# EAGLE design bmsselect (EAGLE 4.13)
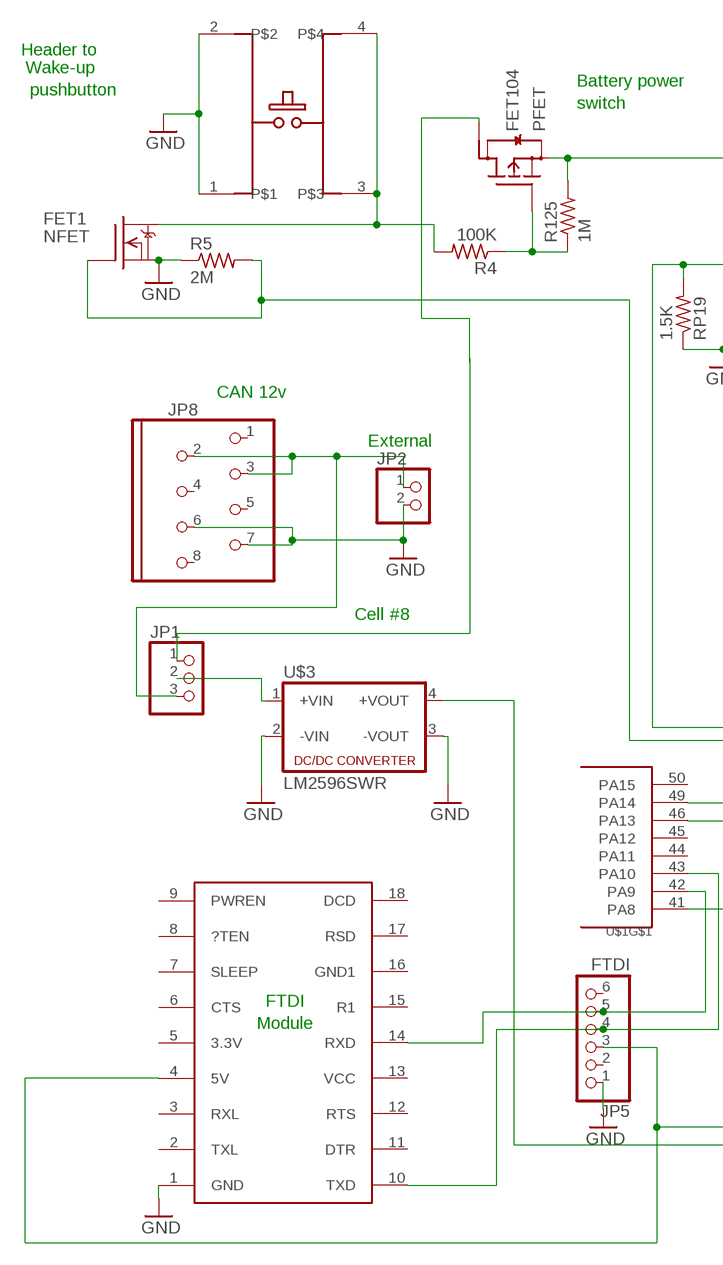
[diagram p0: schematic, sheet 1, part 1 of 2]
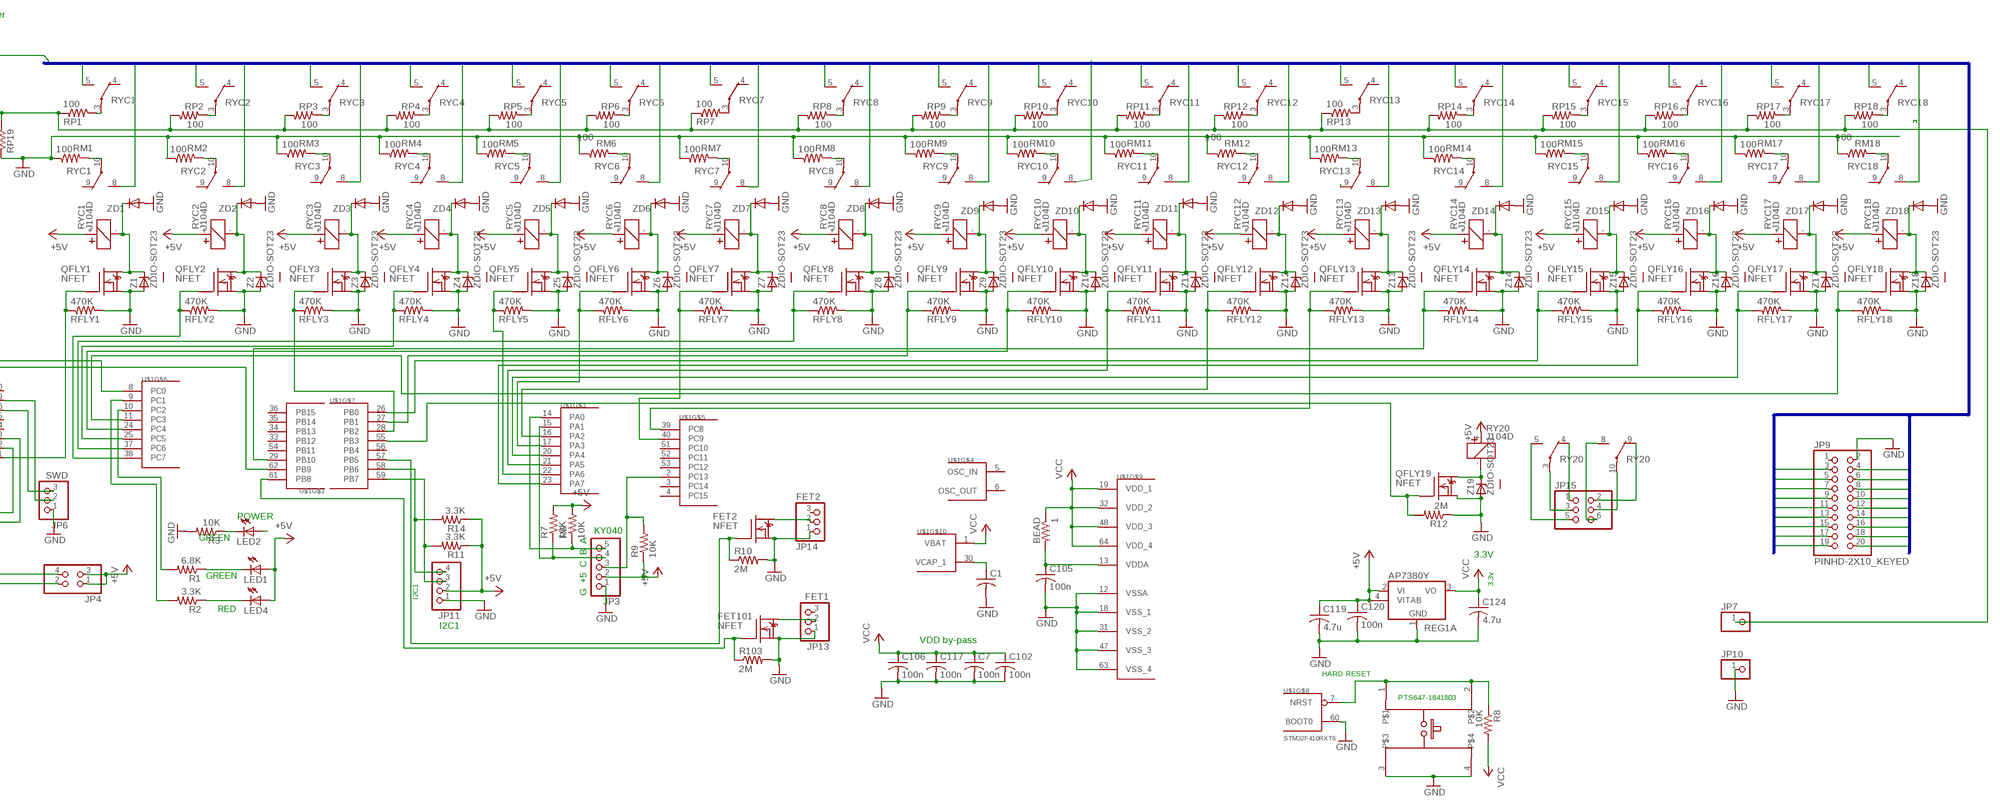
[diagram p1: schematic, sheet 1, part 2 of 2]

## Parts
BEAD  1  R-US_R0603  [R0603]
C1  C-USC0805  [C0805]
C7  100n  C-USC0603  [C0603]
C102  100n  C-USC0603  [C0603]
C105  100n  C-USC0603  [C0603]
C106  100n  C-USC0603  [C0603]
C117  100n  C-USC0603  [C0603]
C119  4.7u  C-USC0805  [C0805]
C120  100n  C-USC0603  [C0603]
C124  4.7u  C-USC0603  [C0603]
FET1  NFET  DMN3404L  [SOT-23]
FET2  NFET  DMN3404L  [SOT-23]
FET101  NFET  DMN3404L  [SOT-23]
FET104  PFET  FET-P-SOT23  [SOT-23]
JP1  PINHD-1X3  [1X03]
JP2  PINHD-1X2  [1X02]
JP3  PINHD-1X5  [1X05]
JP4  PINHD-2X2  [2X02]
JP5  FTDI  PINHD-1X6  [1X06]
JP6  SWD  PINHD-1X3  [1X03]
JP7  PINHD-1X1  [1X01]
JP8  MOD8P8C  [MOD8P8C]
JP9  PINHD-2X10_KEYED  [2X10_KEYED]
JP10  PINHD-1X1  [1X01]
JP11  PINHD-1X4  [1X04]
JP13  FET1  PINHD-1X3  [1X03]
JP14  FET2  PINHD-1X3  [1X03]
JP15  PINHD-2X3  [2X03]
LED1  LEDCHIP-LED0603  [CHIP-LED0603]
LED2  LEDCHIP-LED0603  [CHIP-LED0603]
LED4  LEDCHIP-LED0603  [CHIP-LED0603]
QFLY1  NFET  DMN3404L  [SOT-23]
QFLY2  NFET  DMN3404L  [SOT-23]
QFLY3  NFET  DMN3404L  [SOT-23]
QFLY4  NFET  DMN3404L  [SOT-23]
QFLY5  NFET  DMN3404L  [SOT-23]
QFLY6  NFET  DMN3404L  [SOT-23]
QFLY7  NFET  DMN3404L  [SOT-23]
QFLY8  NFET  DMN3404L  [SOT-23]
QFLY9  NFET  DMN3404L  [SOT-23]
QFLY10  NFET  DMN3404L  [SOT-23]
QFLY11  NFET  DMN3404L  [SOT-23]
QFLY12  NFET  DMN3404L  [SOT-23]
QFLY13  NFET  DMN3404L  [SOT-23]
QFLY14  NFET  DMN3404L  [SOT-23]
QFLY15  NFET  DMN3404L  [SOT-23]
QFLY16  NFET  DMN3404L  [SOT-23]
QFLY17  NFET  DMN3404L  [SOT-23]
QFLY18  NFET  DMN3404L  [SOT-23]
QFLY19  NFET  DMN3404L  [SOT-23]
R1  6.8K  R-US_R0603  [R0603]
R2  3.3K  R-US_R0603  [R0603]
R3  10K  R-US_R0603  [R0603]
R4  100K  R-US_R0603  [R0603]
R5  2M  R-US_R0603  [R0603]
R6  10K  R-US_R0603  [R0603]
R7  10K  R-US_R0603  [R0603]
R8  10K  R-US_R0603  [R0603]
R9  10K  R-US_R0603  [R0603]
R10  2M  R-US_R0603  [R0603]
R11  3.3K  R-US_R0603  [R0603]
R12  2M  R-US_R0603  [R0603]
R14  3.3K  R-US_R0603  [R0603]
R103  2M  R-US_R0603  [R0603]
R125  1M  R-US_R0603  [R0603]
REG1A  AP7380Y  [SOT89]
RESET  E-SWITCH2  [E-SWITCH2]
RESET1  E-SWITCH2  [E-SWITCH2]
RFLY1  470K  R-US_R0603  [R0603]
RFLY2  470K  R-US_R0603  [R0603]
RFLY3  470K  R-US_R0603  [R0603]
RFLY4  470K  R-US_R0603  [R0603]
RFLY5  470K  R-US_R0603  [R0603]
RFLY6  470K  R-US_R0603  [R0603]
RFLY7  470K  R-US_R0603  [R0603]
RFLY8  470K  R-US_R0603  [R0603]
RFLY9  470K  R-US_R0603  [R0603]
RFLY10  470K  R-US_R0603  [R0603]
RFLY11  470K  R-US_R0603  [R0603]
RFLY12  470K  R-US_R0603  [R0603]
RFLY13  470K  R-US_R0603  [R0603]
RFLY14  470K  R-US_R0603  [R0603]
RFLY15  470K  R-US_R0603  [R0603]
RFLY16  470K  R-US_R0603  [R0603]
RFLY17  470K  R-US_R0603  [R0603]
RFLY18  470K  R-US_R0603  [R0603]
RM1  100  R-US_R0603  [R0603]
RM2  100  R-US_R0603  [R0603]
RM3  100  R-US_R0603  [R0603]
RM4  100  R-US_R0603  [R0603]
RM5  100  R-US_R0603  [R0603]
RM6  100  R-US_R0603  [R0603]
RM7  100  R-US_R0603  [R0603]
RM8  100  R-US_R0603  [R0603]
RM9  100  R-US_R0603  [R0603]
RM10  100  R-US_R0603  [R0603]
RM11  100  R-US_R0603  [R0603]
RM12  100  R-US_R0603  [R0603]
RM13  100  R-US_R0603  [R0603]
RM14  100  R-US_R0603  [R0603]
RM15  100  R-US_R0603  [R0603]
RM16  100  R-US_R0603  [R0603]
RM17  100  R-US_R0603  [R0603]
RM18  100  R-US_R0603  [R0603]
RP1  100  R-US_R0603  [R0603]
RP2  100  R-US_R0603  [R0603]
RP3  100  R-US_R0603  [R0603]
RP4  100  R-US_R0603  [R0603]
RP5  100  R-US_R0603  [R0603]
RP6  100  R-US_R0603  [R0603]
RP7  100  R-US_R0603  [R0603]
RP8  100  R-US_R0603  [R0603]
RP9  100  R-US_R0603  [R0603]
RP10  100  R-US_R0603  [R0603]
RP11  100  R-US_R0603  [R0603]
RP12  100  R-US_R0603  [R0603]
RP13  100  R-US_R0603  [R0603]
RP14  100  R-US_R0603  [R0603]
RP15  100  R-US_R0603  [R0603]
RP16  100  R-US_R0603  [R0603]
RP17  100  R-US_R0603  [R0603]
RP18  100  R-US_R0603  [R0603]
RP19  1.5K  R-US_R0603  [R0603]
RY20  J104D  [J104D]
RYC1  J104D  [J104D]
RYC2  J104D  [J104D]
RYC3  J104D  [J104D]
RYC4  J104D  [J104D]
RYC5  J104D  [J104D]
RYC6  J104D  [J104D]
RYC7  J104D  [J104D]
RYC8  J104D  [J104D]
RYC9  J104D  [J104D]
RYC10  J104D  [J104D]
RYC11  J104D  [J104D]
RYC12  J104D  [J104D]
RYC13  J104D  [J104D]
RYC14  J104D  [J104D]
RYC15  J104D  [J104D]
RYC16  J104D  [J104D]
RYC17  J104D  [J104D]
RYC18  J104D  [J104D]
U$1  STM32F410RXT6  [TQFP64]
U$3  LM2596SWR  [LM2596SW]
USB-SERIAL  USB-UART  [USB-UART]
Z1  ZDIO-SOT23  [SOT-23]
Z2  ZDIO-SOT23  [SOT-23]
Z3  ZDIO-SOT23  [SOT-23]
Z4  ZDIO-SOT23  [SOT-23]
Z5  ZDIO-SOT23  [SOT-23]
Z6  ZDIO-SOT23  [SOT-23]
Z7  ZDIO-SOT23  [SOT-23]
Z8  ZDIO-SOT23  [SOT-23]
Z9  ZDIO-SOT23  [SOT-23]
Z10  ZDIO-SOT23  [SOT-23]
Z11  ZDIO-SOT23  [SOT-23]
Z12  ZDIO-SOT23  [SOT-23]
Z13  ZDIO-SOT23  [SOT-23]
Z14  ZDIO-SOT23  [SOT-23]
Z15  ZDIO-SOT23  [SOT-23]
Z16  ZDIO-SOT23  [SOT-23]
Z17  ZDIO-SOT23  [SOT-23]
Z18  ZDIO-SOT23  [SOT-23]
Z19  ZDIO-SOT23  [SOT-23]
ZD1  DIODE-SOD80C  [SOD80C]
ZD2  DIODE-SOD80C  [SOD80C]
ZD3  DIODE-SOD80C  [SOD80C]
ZD4  DIODE-SOD80C  [SOD80C]
ZD5  DIODE-SOD80C  [SOD80C]
ZD6  DIODE-SOD80C  [SOD80C]
ZD7  DIODE-SOD80C  [SOD80C]
ZD8  DIODE-SOD80C  [SOD80C]
ZD9  DIODE-SOD80C  [SOD80C]
ZD10  DIODE-SOD80C  [SOD80C]
ZD11  DIODE-SOD80C  [SOD80C]
ZD12  DIODE-SOD80C  [SOD80C]
ZD13  DIODE-SOD80C  [SOD80C]
ZD14  DIODE-SOD80C  [SOD80C]
ZD15  DIODE-SOD80C  [SOD80C]
ZD16  DIODE-SOD80C  [SOD80C]
ZD17  DIODE-SOD80C  [SOD80C]
ZD18  DIODE-SOD80C  [SOD80C]

## Nets
1-KY040-BN$21: JP3.4 R7.1 U$1.15(PA1)
5VDC-DC: JP4.2 U$3.4(+VOUT)
+5V: C119.1 C120.1 JP3.2 JP4.1 JP4.3 JP11.2 LED1.A LED2.A LED4.A R6.2 R7.2 R9.1 R11.1 R14.1 REG1A.2(VI) REG1A.4(VITAB) RY20.+ RYC1.+ RYC2.+ RYC3.+ RYC4.+ RYC5.+ RYC6.+ RYC7.+ RYC8.+ RYC9.+ RYC10.+ RYC11.+ RYC12.+ RYC13.+ RYC14.+ RYC15.+ RYC16.+ RYC17.+ RYC18.+
BATSW-NDRAIN: FET1.3(D) R4.2 RESET1.3 RESET1.4
BATSW-PGATE: FET104.1(G) R4.1 R125.1
C0: RYC1.8(S)
C1: JP9.12 RYC1.5(S) RYC2.8(S)
C2: JP9.3 RYC2.5(S) RYC3.8(S)
C3: JP9.13 RYC3.5(S) RYC4.8(S)
C4: JP9.4 RYC4.5(S) RYC5.8(S)
C5: JP9.14 RYC5.5(S) RYC6.8(S)
C6: JP9.5 RYC6.5(S) RYC7.8(S)
C7: JP9.15 RYC7.5(S) RYC8.8(S)
C8: FET104.2(S) JP9.6 R125.2 RYC8.5(S) RYC9.8(S)
C9: JP9.16 RYC9.5(S) RYC10.8(S)
C10: JP9.7 RYC10.5(S) RYC11.8(S)
C11: JP9.17 RYC11.5(S) RYC12.8(S)
C12: JP9.8 RYC12.5(S) RYC13.8(S)
C13: JP9.18 RYC13.5(S) RYC14.8(S)
C14: JP9.9 RYC14.5(S) RYC15.8(S)
C15: JP9.19 RYC15.5(S) RYC16.8(S)
C16: JP9.10 RYC16.5(S) RYC17.8(S)
C17: JP9.20 RYC17.5(S) RYC18.8(S)
C18: JP9.11 RYC18.5(S)
C20: RYC13.9(O)
CELL8-PFET-DRAIN: FET104.3(D) JP1.1
EXTERNAL_7-35V: JP1.3 JP2.1 JP8.2 JP8.3
FET1-DRAIN: FET101.3(D) JP13.2
FET2-DRAIN: FET2.3(D) JP14.2
GND: C1.2 C7.2 C102.2 C105.2 C106.2 C117.2 C119.2 C120.2 C124.2 FET1.2(S) FET2.2(S) FET101.2(S) JP2.2 JP3.1 JP5.1 JP6.1 JP8.6 JP8.7 JP9.2 JP10.1 JP11.1 JP13.1 JP14.1 QFLY1.2(S) QFLY2.2(S) QFLY3.2(S) QFLY4.2(S) QFLY5.2(S) QFLY6.2(S) QFLY7.2(S) QFLY8.2(S) QFLY9.2(S) QFLY10.2(S) QFLY11.2(S) QFLY12.2(S) QFLY13.2(S) QFLY14.2(S) QFLY15.2(S) QFLY16.2(S) QFLY17.2(S) QFLY18.2(S) QFLY19.2(S) R3.2 R5.1 R10.2 R12.1 R103.2 REG1A.1(GND) RESET1.1 RESET1.2 RESET.3 RESET.4 RFLY1.2 RFLY2.2 RFLY3.2 RFLY4.2 RFLY5.2 RFLY6.2 RFLY7.2 RFLY8.2 RFLY9.2 RFLY10.2 RFLY11.2 RFLY12.2 RFLY13.2 RFLY14.2 RFLY15.2 RFLY16.2 RFLY17.2 RFLY18.2 RM1.1 RM2.1 RM3.1 RM4.1 RM5.1 RM6.1 RM7.1 RM8.1 RM9.1 RM10.1 RM11.1 RM12.1 RM13.1 RM14.1 RM15.1 RM16.1 RM17.1 RM18.1 RP19.1 U$1.12(VSSA) U$1.18(VSS_1) U$1.31(VSS_2) U$1.47(VSS_3) U$1.60(BOOT0) U$1.63(VSS_4) U$3.2(-VIN) U$3.3(-VOUT) USB-SERIAL.1(GND) Z1.1(A) Z2.1(A) Z3.1(A) Z4.1(A) Z5.1(A) Z6.1(A) Z7.1(A) Z8.1(A) Z9.1(A) Z10.1(A) Z11.1(A) Z12.1(A) Z13.1(A) Z14.1(A) Z15.1(A) Z16.1(A) Z17.1(A) Z18.1(A) Z19.1(A) ZD1.A ZD2.A ZD3.A ZD4.A ZD5.A ZD6.A ZD7.A ZD8.A ZD9.A ZD10.A ZD11.A ZD12.A ZD13.A ZD14.A ZD15.A ZD16.A ZD17.A ZD18.A
LED-EXT-GRN-CATHODE1: LED1.C R1.1
LED-EXT-GRN-CATHODE2: LED2.C R3.1
LED-EXT-RED-CATHODE1: LED4.C R2.1
N$2: RM1.2 RYC1.10(P)
N$3: RP2.1 RYC2.3(P)
N$4: RM4.2 RYC4.10(P)
N$5: RM3.2 RYC3.10(P)
N$6: RM2.2 RYC2.10(P)
N$7: RM5.2 RYC5.10(P)
N$8: RM6.2 RYC6.10(P)
N$9: JP1.2 U$3.1(+VIN)
N$12: RP10.1 RYC10.3(P)
N$13: JP15.1 RY20.4(O)
N$14: RP11.1 RYC11.3(P)
N$16: RP12.1 RYC12.3(P)
N$17: RP7.2 RYC7.3(P)
N$18: RP8.1 RYC8.3(P)
N$19: RP9.1 RYC9.3(P)
N$20: JP3.3 R9.2 U$1.2(PC13)
N$21: JP15.2 RY20.9(O)
N$22: JP15.4 RY20.10(P)
N$23: JP15.3 RY20.3(P)
N$25: JP15.6 RY20.8(S)
N$26: JP15.5 RY20.5(S)
N$29: RP3.1 RYC3.3(P)
N$31: RP1.2 RYC1.3(P)
N$34: RM7.2 RYC7.10(P)
N$35: RM10.2 RYC10.10(P)
N$36: RM9.2 RYC9.10(P)
N$37: RM8.2 RYC8.10(P)
N$38: RM11.2 RYC11.10(P)
N$39: RM12.2 RYC12.10(P)
N$43: RP16.1 RYC16.3(P)
N$44: RP17.1 RYC17.3(P)
N$45: RP18.1 RYC18.3(P)
N$46: RP13.2 RYC13.3(P)
N$47: RP14.1 RYC14.3(P)
N$48: RP15.1 RYC15.3(P)
N$49: RP4.1 RYC4.3(P)
N$50: RP5.1 RYC5.3(P)
N$51: RP6.1 RYC6.3(P)
N$58: RM13.2 RYC13.10(P)
N$59: RM16.2 RYC16.10(P)
N$60: RM15.2 RYC15.10(P)
N$61: RM14.2 RYC14.10(P)
N$62: RM17.2 RYC17.10(P)
N$63: RM18.2 RYC18.10(P)
NRST: R8.1 RESET.1 RESET.2 U$1.7(NRST)
PA0-KY040-A: JP3.5 R6.1 U$1.14(PA0)
PA2-QFLY12: QFLY12.1(G) RFLY12.1 U$1.16(PA2)
PA3-QFLY6: QFLY6.1(G) RFLY6.1 U$1.17(PA3)
PA4-QFLY17: QFLY17.1(G) RFLY17.1 U$1.20(PA4)
PA5-QFLY11: QFLY11.1(G) RFLY11.1 U$1.21(PA5)
PA6-QFLY5: QFLY5.1(G) RFLY5.1 U$1.22(PA6)
PA7-QFLY16: QFLY16.1(G) RFLY16.1 U$1.23(PA7)
PA8-QFLY1: QFLY1.1(G) RFLY1.1 U$1.41(PA8)
PA9-USART1-TX: JP5.5 U$1.42(PA9) USB-SERIAL.14(RXD)
PA10-USART1-RX: JP5.4 U$1.43(PA10) USB-SERIAL.10(TXD)
PA13-SWDIO: JP6.3 U$1.46(PA13)
PA14-SWCLK: JP6.2 U$1.49(PA14)
PB0-QFLY15: QFLY15.1(G) RFLY15.1 U$1.26(PB0)
PB1-QFLY9: QFLY9.1(G) RFLY9.1 U$1.27(PB1)
PB2-QFLY3: QFLY3.1(G) RFLY3.1 U$1.28(PB2)
PB3-RY19-FET-GATE: QFLY19.1(G) R12.2 U$1.55(PB3)
PB5-FET2-GATE: FET2.1(G) R10.1 U$1.57(PB5)
PB6-I2C1-SCL: JP11.4 R14.2 U$1.58(PB6)
PB7-I2C2-SDA: JP11.3 R11.2 U$1.59(PB7)
PB8-FET1-GATE: FET101.1(G) R103.1 U$1.61(PB8)
PB9-CELL8-NFET: FET1.1(G) R5.2 U$1.62(PB9)
PB10-QFLY14: QFLY14.1(G) RFLY14.1 U$1.29(PB10)
PC0-IN10: JP7.1 RP1.1 RP2.2 RP3.2 RP4.2 RP5.2 RP6.2 RP7.1 RP8.2 RP9.2 RP10.2 RP11.2 RP12.2 RP13.1 RP14.2 RP15.2 RP16.2 RP17.2 RP18.2 RP19.2 U$1.8(PC0)
PC1-LED-RED: R2.2 U$1.9(PC1)
PC2-LED-GRN: R1.2 U$1.10(PC2)
PC3-QFLY18: QFLY18.1(G) RFLY18.1 U$1.11(PC3)
PC4-QFLY10: QFLY10.1(G) RFLY10.1 U$1.24(PC4)
PC5-QFLY4: QFLY4.1(G) RFLY4.1 U$1.25(PC5)
PC6-QFLY8: QFLY8.1(G) RFLY8.1 U$1.37(PC6)
PC7-QFLY2: QFLY2.1(G) RFLY2.1 U$1.38(PC7)
PC8-QFLY13: QFLY13.1(G) RFLY13.1 U$1.39(PC8)
PC9-QFLY7: QFLY7.1(G) RFLY7.1 U$1.40(PC9)
QDFLY1: QFLY1.3(D) RYC1.- Z1.3(C) ZD1.C
QDFLY2: QFLY2.3(D) RYC2.- Z2.3(C) ZD2.C
QDFLY3: QFLY3.3(D) RYC3.- Z3.3(C) ZD3.C
QDFLY4: QFLY4.3(D) RYC4.- Z4.3(C) ZD4.C
QDFLY5: QFLY5.3(D) RYC5.- Z5.3(C) ZD5.C
QDFLY6: QFLY6.3(D) RYC6.- Z6.3(C) ZD6.C
QDFLY7: QFLY7.3(D) RYC7.- Z7.3(C) ZD7.C
QDFLY8: QFLY8.3(D) RYC8.- Z8.3(C) ZD8.C
QDFLY9: QFLY9.3(D) RYC9.- Z9.3(C) ZD9.C
QDFLY10: QFLY10.3(D) RYC10.- Z10.3(C) ZD10.C
QDFLY11: QFLY11.3(D) RYC11.- Z11.3(C) ZD11.C
QDFLY12: QFLY12.3(D) RYC12.- Z12.3(C) ZD12.C
QDFLY13: QFLY13.3(D) RYC13.- Z13.3(C) ZD13.C
QDFLY14: QFLY14.3(D) RYC14.- Z14.3(C) ZD14.C
QDFLY15: QFLY15.3(D) RYC15.- Z15.3(C) ZD15.C
QDFLY16: QFLY16.3(D) RYC16.- Z16.3(C) ZD16.C
QDFLY17: QFLY17.3(D) RYC17.- Z17.3(C) ZD17.C
QDFLY18: QFLY18.3(D) RYC18.- Z18.3(C) ZD18.C
QFLY19-DRAIN: QFLY19.3(D) RY20.- Z19.3(C)
USB-SERIAL-5V: JP4.4 JP5.3 USB-SERIAL.4(5V)
VCAP_1: C1.1 U$1.30(VCAP_1)
VCC: BEAD.1 C7.1 C102.1 C106.1 C117.1 C124.1 R8.2 REG1A.3(VO) U$1.1(VBAT) U$1.19(VDD_1) U$1.32(VDD_2) U$1.48(VDD_3) U$1.64(VDD_4)
VDDA: BEAD.2 C105.1 U$1.13(VDDA)
Unconnected: JP5.2 JP5.6 JP8.1 JP8.4 JP8.5 JP8.8 JP9.1 JP13.3 JP14.3 RYC1.4(O) RYC1.9(O) RYC2.4(O) RYC2.9(O) RYC3.4(O) RYC3.9(O) RYC4.4(O) RYC4.9(O) RYC5.4(O) RYC5.9(O) RYC6.4(O) RYC6.9(O) RYC7.4(O) RYC7.9(O) RYC8.4(O) RYC8.9(O) RYC9.4(O) RYC9.9(O) RYC10.4(O) RYC10.9(O) RYC11.4(O) RYC11.9(O) RYC12.4(O) RYC12.9(O) RYC13.4(O) RYC14.4(O) RYC14.9(O) RYC15.4(O) RYC15.9(O) RYC16.4(O) RYC16.9(O) RYC17.4(O) RYC17.9(O) RYC18.4(O) RYC18.9(O) U$1.3(PC14) U$1.4(PC15) U$1.5(OSC_IN) U$1.6(OSC_OUT) U$1.33(PB12) U$1.34(PB13) U$1.35(PB14) U$1.36(PB15) U$1.44(PA11) U$1.45(PA12) U$1.50(PA15) U$1.51(PC10) U$1.52(PC11) U$1.53(PC12) U$1.54(PB11) U$1.56(PB4) USB-SERIAL.2(TXL) USB-SERIAL.3(RXL) USB-SERIAL.5(3.3V) USB-SERIAL.6(CTS) USB-SERIAL.7(SLEEP) USB-SERIAL.8(?TEN) USB-SERIAL.9(PWREN) USB-SERIAL.11(DTR) USB-SERIAL.12(RTS) USB-SERIAL.13(VCC) USB-SERIAL.15(R1) USB-SERIAL.16(GND1) USB-SERIAL.17(RSD) USB-SERIAL.18(DCD) Z1.2(NC) Z2.2(NC) Z3.2(NC) Z4.2(NC) Z5.2(NC) Z6.2(NC) Z7.2(NC) Z8.2(NC) Z9.2(NC) Z10.2(NC) Z11.2(NC) Z12.2(NC) Z13.2(NC) Z14.2(NC) Z15.2(NC) Z16.2(NC) Z17.2(NC) Z18.2(NC) Z19.2(NC)

## Buses
C$1:C[0..18]

## Notes on the sheet
- Header to
- Wake-up
- Battery power
- pushbutton
- switch
- CAN 12v
- External
- Cell #8
- FTDI
- Module | POWER
- KY040
- GREEN
- 3.3V
- 3.3v
- GREEN
- I2C1
- G  +5  C  B  A
- RED
- I2C1
- VDD by-pass
- HARD | RESET
- PTS647-1841803

## Library data of the parts
BEAD R1-R12 R14 R103 R125 RFLY1-RFLY18 RM1-RM18 RP1-RP19 = rcl:R-US_: RESISTOR, American symbol
C1 C7 C102 C105 C106 C117 C119 C120 C124 = rcl:C-US: CAPACITOR, American symbol
FET1 FET2 FET101 QFLY1-QFLY19 = transistor-fet:DMN3404L
FET104 = transistor-fet:FET-P-SOT23
JP1 JP6 JP13 JP14 = pinhead:PINHD-1X3: PIN HEADER
JP2 = pinhead:PINHD-1X2: PIN HEADER
JP3 = pinhead:PINHD-1X5: PIN HEADER
JP4 = pinhead:PINHD-2X2: PIN HEADER
JP5 = pinhead:PINHD-1X6: PIN HEADER
JP7 JP10 = pinhead:PINHD-1X1: PIN HEADER
JP8 = DEH:MOD8P8C
JP9 = pinhead:PINHD-2X10_KEYED
JP11 = pinhead:PINHD-1X4: PIN HEADER
JP15 = pinhead:PINHD-2X3: PIN HEADER
LED1 LED2 LED4 = led:LED: LED OSRAM: - CHIPLED LG R971, LG N971, LY N971, LG Q971, LY Q971, LO R971, LY R971 LH N974, LH R974 LS Q976, LO Q976, LY Q976 LO Q996 - Hyper CHIPLED LW Q18S LB Q993, LB Q99A, LB R99A - SideLED LS A670, LO A670, LY A670, LG A670, LP A670 LB A673, LV A673, LT A673, LW A673 LH A674 LY A675 LS A676, LA A676, LO A676, LY A676, LW A676 LS A679, LY A679, LG A679 - Hyper Micro SIDELED® LS Y876, LA Y876, LO Y876, LY Y876 LT Y87S - SmartLED LW L88C, LW L88S LB L89C, LB L89S, LG L890 LS L89K, LO L89K, LY L89K LS L896, LA L896, LO L896, LY L896 - TOPLED LS T670, LO T670, LY T670, LG T670, LP T670 LSG T670, LSP T670, LSY T670, LOP T670, LYG T670 LG T671, LOG T671, LSG T671 LB T673, LV T673, LT T673, LW T673 LH T674 LS T676, LA T676, LO T676, LY T676, LB T676, LH T676, LSB T676, LW T676 LB T67C, LV T67C, LT T67C, LS T67K, LO T67K, LY T67K, LW E67C LS E67B, LA E67B, LO E67B, LY E67B, LB E67C, LV E67C, LT E67C LW T67C LS T679, LY T679, LG T679 LS T770, LO T770, LY T770, LG T770, LP T770 LB T773, LV T773, LT T773, LW T773 LH T774 LS E675, LA E675, LY E675, LS T675 LS T776, LA T776, LO T776, LY T776, LB T776 LHGB T686 LT T68C, LB T68C - Hyper Mini TOPLED® LB M676 - Mini TOPLED Santana® LG M470 LS M47K, LO M47K, LY M47K Source: http://www.osram.convergy.de/
REG1A = linear:AP7380Y
RESET RESET1 = switch-misc:E-SWITCH2
RY20 RYC1-RYC18 = relay:J104D
U$1 = stm32:STM32F410RXT6
U$3 = dc-dc-converter:LM2596SWR
USB-SERIAL = pinhead:USB-UART
Z1-Z19 = DEH:ZDIO-SOT23
ZD1-ZD18 = diode-1:DIODE-: DIODE

## Board
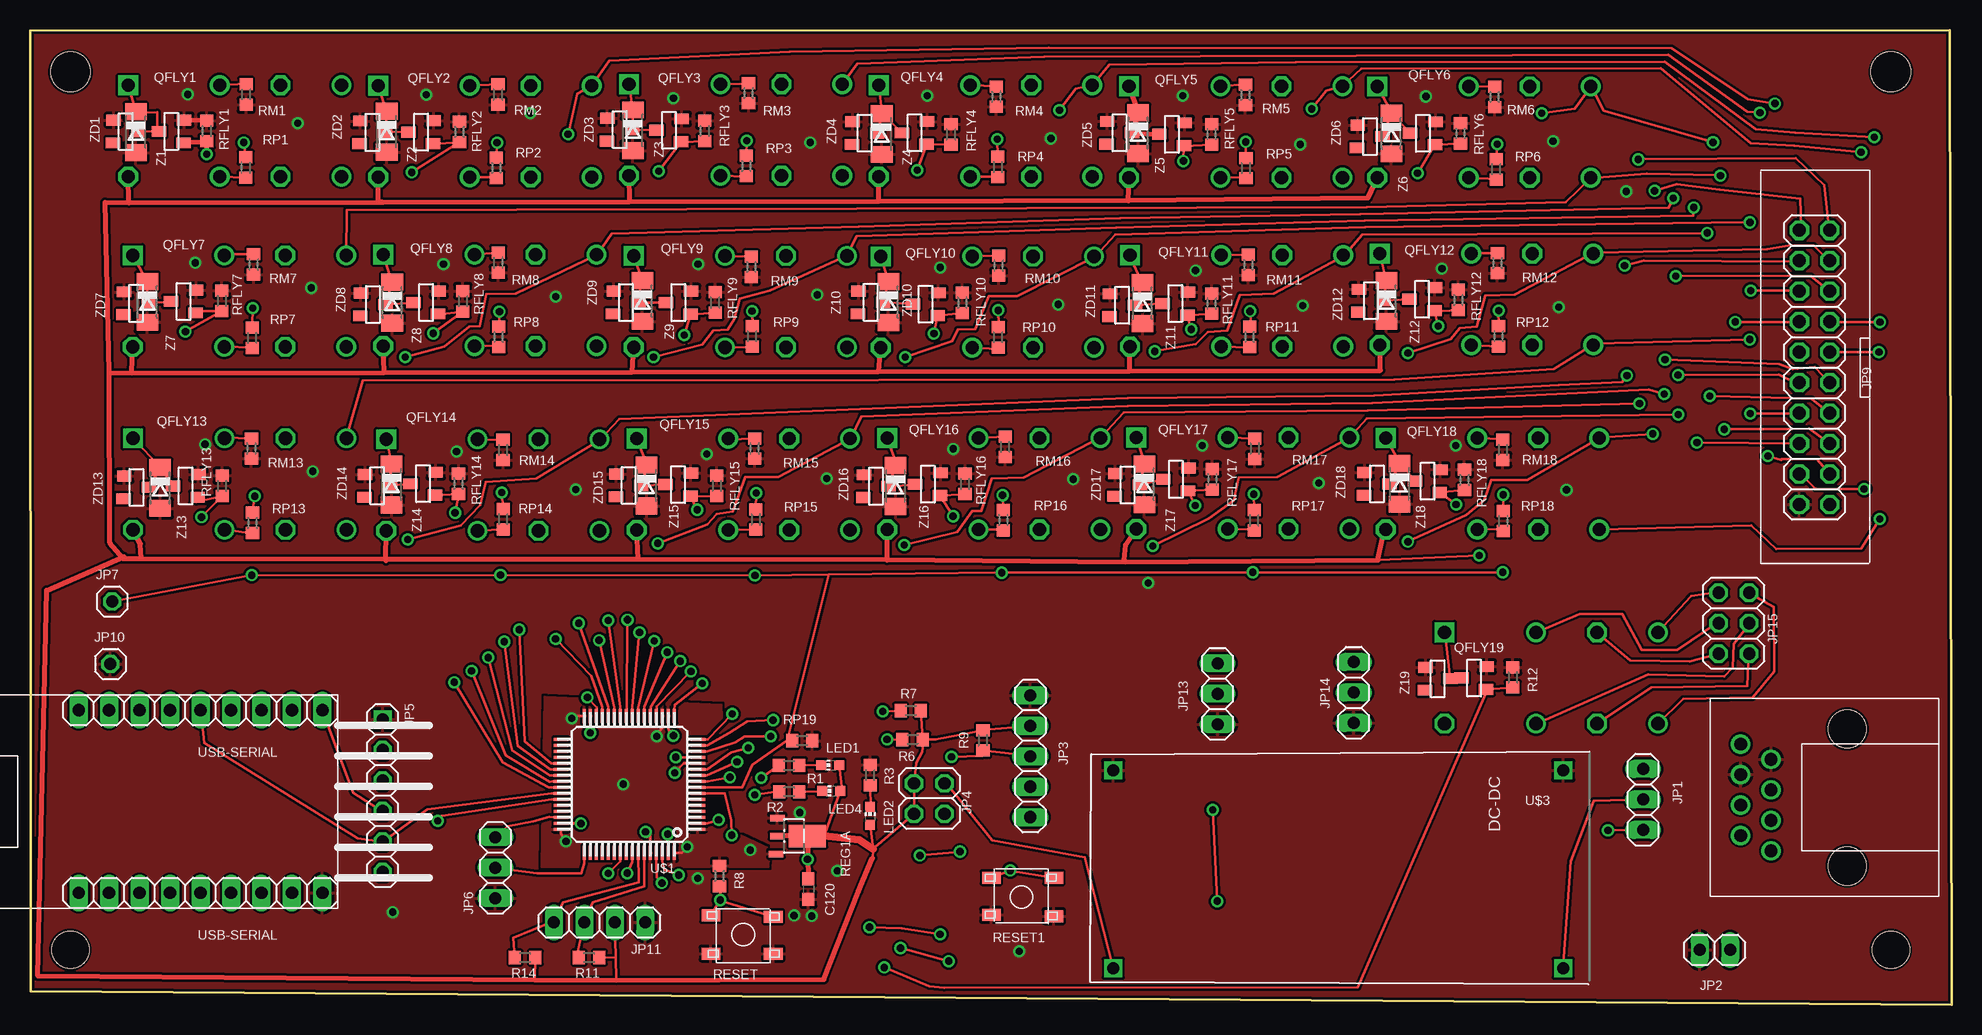
[diagram p2: board, top side]
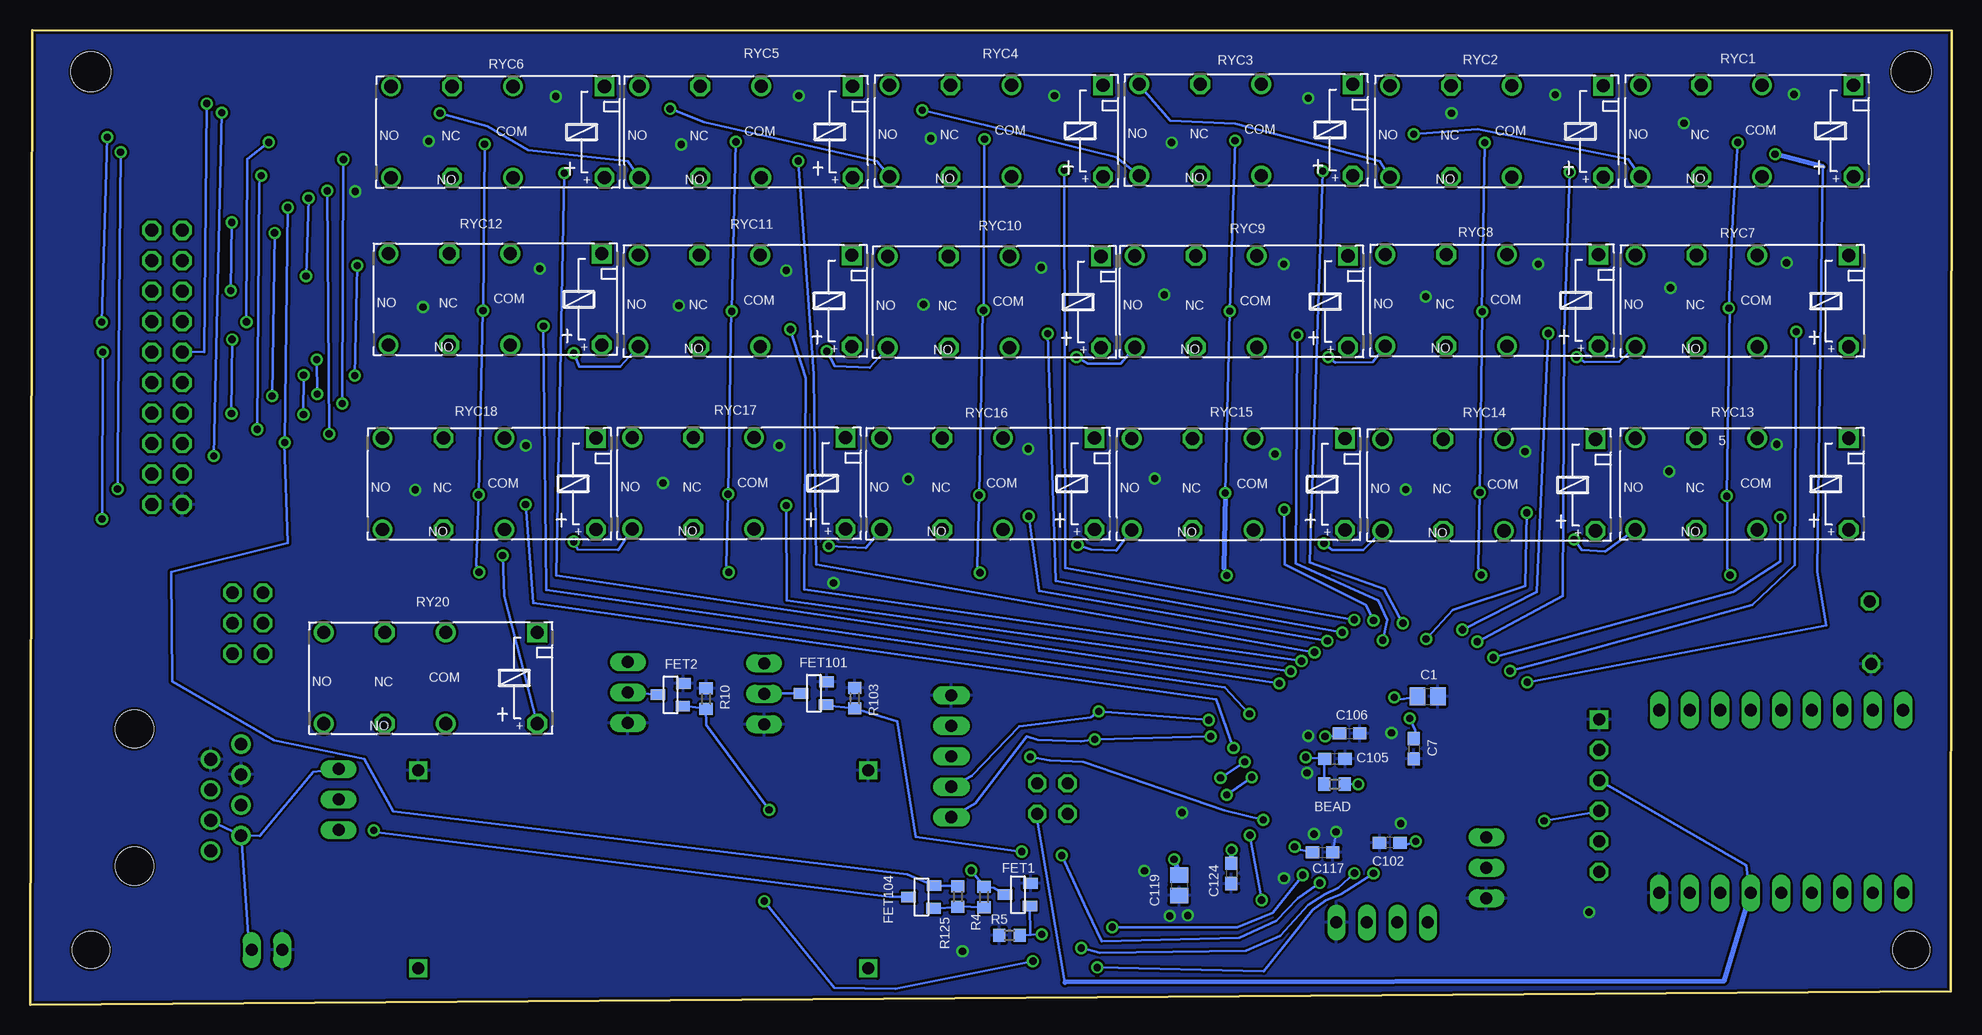
[diagram p3: board, bottom side, seen from below]

Size 160.14 x 81.29 mm. Coordinates in mm from the lower left corner, seen from the top.
Outline: 0.07,1.16 0,81.24 159.97,81.29 160.14,0 0.07,1.16
Copper layers (1*16): Top 0.035mm / dielectric 1.5mm / Bottom 0.035mm
Design rules "default": minimum track width 8mil, minimum drill 0.6mm, track to track 8mil, track to pad 8mil, pad to pad 8mil, via to via 8mil, smd to smd 0mil, copper to edge 8mil, drill to drill 8mil, minimum pad ring 10mil, minimum via ring 8mil, stop-mask expansion 4mil, vias tented up to drill 0mil, thermal gap 10mil
Holes 3.1 mm at 3.37,4.6 155.07,4.6
Holes 3.3 mm at 3.37,77.8 155.07,77.8

### Footprints (pad centres in the part's own frame; a part is rotated, then mirrored left to right if it is on the bottom)
R0603 = smd 1 x 1.1: 1 -0.85,0; 2 0.85,0
C0805 = smd 1.3 x 1.5: 1 -0.85,0; 2 0.85,0
C0603 = smd 1.1 x 1: 1 -0.85,0; 2 0.85,0
SOT-23 = smd 0.9 x 1.2: 1 -1,-1.006; 2 0.9,-1.056; 3 -0.05,1.056
1X03 = drill 1 long: 1 -2.54,0; 2 0,0; 3 2.54,0
1X02 = drill 1 long: 1 -1.27,0; 2 1.27,0
1X05 = drill 1.016 long: 1 -5.08,0; 2 -2.54,0; 3 0,0; 4 2.54,0; 5 5.08,0
2X02 = drill 1.016 octagon: 1 -1.27,-1.27; 2 -1.27,1.27; 3 1.27,-1.27; 4 1.27,1.27
1X06 = drill 1 square: 1 -6.35,0 | drill 1 octagon: 2 -3.81,0; 3 -1.27,0; 4 1.27,0; 5 3.81,0; 6 6.35,0
1X01 = drill 1 octagon: 1 0,0
MOD8P8C = drill 1.067 pad 1.397 round: 1 -3.81,-2.54; 2 -2.54,0; 3 -1.27,-2.54; 4 0,0; 5 1.27,-2.54; 6 2.54,0; 7 3.81,-2.54; 8 5.08,0 | hole 3.175: -5.08,-8.89; 6.35,-8.89
2X10_KEYED = drill 1.067 octagon: 1 -11.46,-1.27; 2 -11.46,1.27; 3 -8.92,-1.27; 4 -8.92,1.27; 5 -6.38,-1.27; 6 -6.38,1.27; 7 -3.84,-1.27; 8 -3.84,1.27; 9 -1.3,-1.27; 10 -1.3,1.27; 11 1.24,-1.27; 12 1.24,1.27; 13 3.78,-1.27; 14 3.78,1.27; 15 6.32,-1.27; 16 6.32,1.27; 17 8.86,-1.27; 18 8.86,1.27; 19 11.4,-1.27; 20 11.4,1.27
1X04 = drill 1 long: 1 -3.81,0; 2 -1.27,0; 3 1.27,0; 4 3.81,0
2X03 = drill 1.016 octagon: 1 -2.54,-1.27; 2 -2.54,1.27; 3 0,-1.27; 4 0,1.27; 5 2.54,-1.27; 6 2.54,1.27
CHIP-LED0603 = smd 0.8 x 0.8: A 0,-0.75; C 0,0.75
SOT89 = smd 0.55 x 1.2: 1 -1.5,-1.4; 2 0,-1.4; 3 1.5,-1.5 | smd 1.85 x 3.1: 4 0,1.1
E-SWITCH2 = smd 1.55 x 1: 1 -2.7,1.6; 2 2.5,1.5; 3 2.5,-1.6; 4 -2.7,-1.6
J104D = drill 1.1 round: 3 0,6.35; 5 10.16,6.35; 8 10.16,-1.27; 10 0,-1.27 | drill 1.1 octagon: 4 5.08,6.35; 9 5.08,-1.27; + -7.62,6.35 | drill 1.1 square: - -7.62,-1.27
TQFP64 = smd 1.2 x 0.26: 1 -5.7,3.75; 2 -5.7,3.25; 3 -5.7,2.75; 4 -5.7,2.25; 5 -5.7,1.75; 6 -5.7,1.25; 7 -5.7,0.75; 8 -5.7,0.25; 9 -5.7,-0.25; 10 -5.7,-0.75; 11 -5.7,-1.25; 12 -5.7,-1.75; 13 -5.7,-2.25; 14 -5.7,-2.75; 15 -5.7,-3.25; 16 -5.7,-3.75; 33 5.7,-3.75; 34 5.7,-3.25; 35 5.7,-2.75; 36 5.7,-2.25; 37 5.7,-1.75; 38 5.7,-1.25; 39 5.7,-0.75; 40 5.7,-0.25; 41 5.7,0.25; 42 5.7,0.75; 43 5.7,1.25; 44 5.7,1.75; 45 5.7,2.25; 46 5.7,2.75; 47 5.7,3.25; 48 5.7,3.75 | smd 0.26 x 1.2: 17 -3.75,-5.7; 18 -3.25,-5.7; 19 -2.75,-5.7; 20 -2.25,-5.7; 21 -1.75,-5.7; 22 -1.25,-5.7; 23 -0.75,-5.7; 24 -0.25,-5.7; 25 0.25,-5.7; 26 0.75,-5.7; 27 1.25,-5.7; 28 1.75,-5.7; 29 2.25,-5.7; 30 2.75,-5.7; 31 3.25,-5.7; 32 3.75,-5.7; 49 3.75,5.7; 50 3.25,5.7; 51 2.75,5.7; 52 2.25,5.7; 53 1.75,5.7; 54 1.25,5.7; 55 0.75,5.7; 56 0.25,5.7; 57 -0.25,5.7; 58 -0.75,5.7; 59 -1.25,5.7; 60 -1.75,5.7; 61 -2.25,5.7; 62 -2.75,5.7; 63 -3.25,5.7; 64 -3.75,5.7
LM2596SW = drill 1 square: 1 0,16.5; 2 0,0; 3 37.5,0; 4 37.5,16.5
USB-UART = drill 1.016 long: 1 -7.62,-8.89; 2 -7.62,-6.35; 3 -7.62,-3.81; 4 -7.62,-1.27; 5 -7.62,1.27; 6 -7.62,3.81; 7 -7.62,6.35; 8 -7.62,8.89; 9 -7.62,11.43; 10 7.62,-8.89; 11 7.62,-6.35; 12 7.62,-3.81; 13 7.62,-1.27; 14 7.62,1.27; 15 7.62,3.81; 16 7.62,6.35; 17 7.62,8.89; 18 7.62,11.43
SOD80C = smd 1.4 x 1.8: A 1.7,0; C -1.7,0

### Placement (x,y rotation side)
BEAD  51.42,18.42 180 bottom
C1  43.67,25.73 0 bottom
C7  44.82,21.36 270 bottom
C102  46.83,13.54 180 bottom
C105  51.4,20.53 0 bottom
C106  50.17,22.64 0 bottom
C117  52.42,12.72 0 bottom
C119  64.38,9.98 270 bottom
C120  64.87,9.66 270 top
C124  60.03,10.97 270 bottom
FET1  77.82,9.25 90 bottom
FET2  106.75,25.92 90 bottom
FET101  94.82,26.04 90 bottom
FET104  85.86,9.05 90 bottom
JP1  134.42,17.13 90 top
JP2  140.41,4.59 180 top
JP3  83.36,20.74 270 top
JP4  74.94,17.21 270 top
JP5  29.39,17.44 270 top
JP6  38.78,11.44 90 top
JP7  6.84,33.64 0 top
JP8  142.55,16.67 90 top
JP9  148.72,53.19 90 top
JP10  6.7,28.43 0 top
JP11  47.46,6.88 180 top
JP13  98.96,25.94 90 top
JP14  110.31,26.05 90 top
JP15  141.99,31.83 90 top
LED1  66.69,20 90 top
LED2  70.01,15.77 0 top
LED4  66.77,17.85 90 top
QFLY1  11.79,72.88 90 top
QFLY2  32.59,72.82 90 top
QFLY3  53.25,72.98 90 top
QFLY4  73.71,72.76 90 top
QFLY5  95.16,72.64 90 top
QFLY6  116.07,72.73 90 top
QFLY7  12.8,58.71 90 top
QFLY8  33.01,58.62 90 top
QFLY9  54.04,58.61 90 top
QFLY10  74.64,58.48 90 top
QFLY11  95.44,58.53 90 top
QFLY12  116.02,58.9 90 top
QFLY13  12.97,43.33 90 top
QFLY14  32.76,43.51 90 top
QFLY15  54.02,43.44 90 top
QFLY16  74.82,43.47 90 top
QFLY17  95.49,43.88 90 top
QFLY18  116.47,43.73 90 top
QFLY19  120.34,27.31 90 top
R1  63.26,19.97 180 top
R2  63.27,17.78 180 top
R3  70.01,19.17 90 top
R4  80.64,9.01 90 bottom
R5  78.52,5.81 0 bottom
R6  73.55,22.13 0 top
R7  73.4,24.54 0 top
R8  57.46,10.76 90 top
R9  79.41,22.06 270 top
R10  103.8,25.53 90 bottom
R11  46.59,3.95 180 top
R12  123.57,27.31 270 top
R14  41.26,3.95 180 top
R103  91.41,25.57 90 bottom
R125  82.82,9.04 90 bottom
REG1A  63.68,14.09 270 top
RESET  59.44,5.87 0 top
RESET1  82.62,9.01 180 top
RFLY1  14.73,72.86 90 top
RFLY2  35.79,72.8 90 top
RFLY3  56.23,72.87 90 top
RFLY4  76.75,72.57 90 top
RFLY5  98.47,72.59 90 top
RFLY6  119.21,72.66 90 top
RFLY7  15.99,58.71 90 top
RFLY8  36.07,58.67 90 top
RFLY9  57.1,58.57 90 top
RFLY10  77.7,58.55 90 top
RFLY11  98.47,58.48 90 top
RFLY12  119.03,58.78 90 top
RFLY13  16.01,43.28 90 top
RFLY14  35.71,43.47 90 top
RFLY15  57.24,43.29 90 top
RFLY16  77.92,43.44 90 top
RFLY17  98.53,43.82 90 top
RFLY18  119.54,43.78 90 top
RM1  18.01,75.91 90 top
RM2  39,75.9 90 top
RM3  59.88,76.02 90 top
RM4  80.53,75.73 90 top
RM5  101.29,75.87 90 top
RM6  122.06,75.71 90 top
RM7  18.63,61.74 90 top
RM8  39.02,61.89 90 top
RM9  60.11,61.54 90 top
RM10  80.72,61.64 90 top
RM11  101.53,61.71 90 top
RM12  122.29,61.85 90 top
RM13  18.45,46.39 90 top
RM14  39.42,46.28 90 top
RM15  60.39,46.39 90 top
RM16  81.26,46.54 90 top
RM17  102.07,46.38 90 top
RM18  122.74,46.29 90 top
RP1  17.98,69.82 270 top
RP2  38.86,69.79 90 top
RP3  59.69,69.95 90 top
RP4  80.65,69.86 90 top
RP5  101.33,69.77 90 top
RP6  122.18,69.68 90 top
RP7  18.51,55.62 270 top
RP8  39.06,55.71 90 top
RP9  60.18,55.75 90 top
RP10  80.68,55.67 90 top
RP11  101.64,55.71 90 top
RP12  122.38,55.75 90 top
RP13  18.54,40.2 270 top
RP14  39.43,40.5 90 top
RP15  60.49,40.48 90 top
RP16  81.11,40.43 90 top
RP17  102.01,40.4 90 top
RP18  122.77,40.35 90 top
RP19  64.35,22.04 180 top
RY20  125.5,29.8 180 bottom
RYC1  15.8,75.42 180 bottom
RYC2  36.65,75.37 180 bottom
RYC3  57.54,75.49 180 bottom
RYC4  78.35,75.41 180 bottom
RYC5  99.21,75.33 180 bottom
RYC6  119.89,75.32 180 bottom
RYC7  16.19,61.23 180 bottom
RYC8  37.05,61.29 180 bottom
RYC9  57.92,61.19 180 bottom
RYC10  78.51,61.15 180 bottom
RYC11  99.28,61.24 180 bottom
RYC12  120.11,61.38 180 bottom
RYC13  16.21,45.98 180 bottom
RYC14  37.3,45.89 180 bottom
RYC15  58.18,45.95 180 bottom
RYC16  79.05,46 180 bottom
RYC17  99.8,46.03 180 bottom
RYC18  120.6,45.99 180 bottom
U$1  49.95,18.4 180 top
U$3  127.77,19.56 180 top
USB-SERIAL  15.48,16.96 90 top
Z1  7.97,72.77 270 top
Z2  28.53,72.7 270 top
Z3  49.13,72.93 270 top
Z4  69.55,72.64 270 top
Z5  90.78,72.67 270 top
Z6  111.65,72.36 270 top
Z7  8.85,58.45 270 top
Z8  28.58,58.35 270 top
Z9  49.65,58.52 270 top
Z10  70.05,58.53 270 top
Z11  91.02,58.29 270 top
Z12  111.74,58.67 270 top
Z13  8.86,43.11 270 top
Z14  28.93,43.24 270 top
Z15  49.88,43.27 270 top
Z16  70.49,43.2 270 top
Z17  91.44,43.32 270 top
Z18  112.23,43.39 270 top
Z19  117.31,27.15 270 top
ZD1  8.82,72.77 270 top
ZD2  29.73,72.81 270 top
ZD3  50.24,72.92 270 top
ZD4  70.98,72.62 270 top
ZD5  92.34,72.69 270 top
ZD6  113.45,72.66 270 top
ZD7  9.78,58.62 270 top
ZD8  30.19,58.56 270 top
ZD9  51.03,58.69 270 top
ZD10  71.54,58.6 270 top
ZD11  92.71,58.52 270 top
ZD12  113.04,58.69 270 top
ZD13  10.84,43.11 270 top
ZD14  30.13,43.39 270 top
ZD15  51.38,43.31 270 top
ZD16  72.14,43.27 270 top
ZD17  92.86,43.41 270 top
ZD18  114.14,43.45 270 top

### Tracks (layer width: path | path; a pad name or v marks a point on that pad's centre or on a via)
1-KY040-BN$21  (via drill 0.6)
  Top 0.203: U$1.15 56.44,21.65 58.26,22.68 59.78,23.64 v61.92,23.75 | R7.1 72.5,24.51 v71.07,24.48
  Bottom 0.203: v61.92,23.75 v71.07,24.48 71.75,23.96 77.7,23.23 81.66,19.1 JP3.4
5VDC-DC
  Top 0.203: U$3.4 87.88,12.32 80.19,13.71 76.27,18.62 JP4.2
+5V  (via drill 0.6)
  Top 0.203: LED1.A 67.67,17.83 LED4.A 66.23,14.23 66.15,14.09 | 70.26,12.98 70.26,13 | 70.26,12.98 70.26,12.96 LED2.A | 48.84,2.08 48.84,2.09 48.8,3.98 | 48.8,3.98 JP11.2 | 48.8,3.98 48.79,3.98 R11.1 | 42.07,2.1 42.07,2.06 R14.1 | 70.23,13.02 70.16,12.92 JP4.3 73.68,18.52 JP4.1 73.84,20.2 74.36,21.12 74.46,22.15 | 70.26,12.98 70.31,12.98 70.2,12.23 | 74.46,22.15 R6.2 74.21,24.57 R7.2 | 74.46,22.15 75.45,22.14 75.46,22.15 R9.1 79.46,22.93 JP3.2 83.44,23.23 | 112.32,37.1 112.39,37.11 v120.76,37.47
  Top 0.406: 8.23,66.88 RYC1.+ | 8.23,66.88 29.4,66.93 | 29.4,66.93 49.97,66.98 | 49.97,66.98 70.71,67.04 | 70.71,67.04 91.54,67.09 | 91.54,67.09 111.52,67.3 112.32,69.02 RYC6.+ | 91.54,67.09 91.54,67.05 RYC5.+ | 70.71,67.04 70.71,67.01 RYC4.+ | 49.97,66.98 49.97,67.05 RYC3.+ | 29.4,66.93 29.01,66.97 RYC2.+ | 8.23,66.88 6.26,66.92 6.6,52.72 | 6.6,52.72 6.66,38.52 7.75,37.21 7.85,37.21 | 8.45,39.82 RYC13.+ 9.19,38.45 9.28,37.21 | 6.6,52.72 8.49,52.69 | 8.49,52.69 29.53,52.74 | 29.53,52.74 50.18,52.78 | 50.18,52.78 70.71,52.82 | 70.71,52.82 91.63,52.87 | 91.63,52.87 112.54,52.91 112.54,55 RYC12.+ | 91.63,52.87 91.63,52.95 RYC11.+ | 70.71,52.82 RYC10.+ | 50.18,52.78 | 50.18,52.78 RYC9.+ | 29.53,52.74 29.53,52.78 RYC8.+ | 8.49,52.69 8.49,52.78 RYC7.+ | 7.85,37.21 9.28,37.21 | 9.28,37.21 29.66,37.19 | 29.66,37.19 50.68,37.17 | 50.68,37.17 71.43,37.14 | 71.43,37.14 91.25,36.94 | 91.25,36.94 112.32,37.1 112.91,39.71 RYC18.+ | 29.66,37.19 29.66,37.06 RYC14.+ | 50.68,37.17 50.68,37.2 RYC15.+ | 71.43,37.14 71.43,37.1 | 71.43,37.14 RYC16.+ | RYC17.+ 91.3,38.37 91.2,37.1 91.25,36.94 | REG1A.4 v64.8,12.15 | C120.1 64.87,10.56 REG1A.4 | REG1A.4 64.79,14.12 REG1A.2 | 7.85,37.21 7.85,37.39 1.39,34.58 0.65,2.42 42.07,2.1 48.84,2.08 66.16,2.13 69.04,9.44 70.2,12.23
  Top 0.61: 70.26,13 70.23,13.02 69.1,13.78 66.15,14.09 64.85,14.12 REG1A.4 64.77,14.05
  Bottom 0.203: RY20.+ 120.6,34.1 v120.76,37.47
  Bottom 0.406: v64.8,12.15 C119.1
BATSW-NDRAIN  (via drill 0.6)
  Top 0.203: RESET1.3 80.15,10.62 v81.69,11.21 81.7,11.19 RESET1.4
  Bottom 0.203: FET1.3 79.84,9.79 80.67,9.82 R4.2 v81.69,11.21
BATSW-PGATE
  Bottom 0.203: R4.1 82.85,8.21 R125.1 84.8,8.02 FET104.1
C1  (via drill 0.6)
  Top 0.203: v44.84,72.61 45.61,75.99 46.75,76.62 RYC2.8 48.27,78.74 63.32,79.46 84.89,79.83 136.83,79.79 143.14,75.5 v145.41,75.16
  Bottom 0.203: RYC1.5 26.96,70.51 39.49,73.04 v44.84,72.61 | v145.41,75.16 145.63,54.44 147.44,54.48 JP9.12
C2  (via drill 0.6)
  Top 0.203: JP9.3 148.91,45.52 145.96,45.52 145.95,45.45 v144.83,45.77 | RYC3.8 68.94,78.46 84.54,79.08 136.53,79.24 143.1,74.46 v144.16,74.39
  Bottom 0.203: RYC2.5 47.66,70.37 59.72,73.47 65.12,73.71 67.82,76.84 RYC3.8 | v144.16,74.39 v144.83,45.77
C3  (via drill 0.6)
  Top 0.203: v85.79,74.59 87.15,76.39 88.55,76.72 | 88.55,76.72 RYC4.8 | 88.55,76.72 89.94,78.38 105.49,78.62 136.23,78.66 143.82,73.04 147.09,72.72 v153.7,72.34 | JP9.13 149.94,56.94 v154.16,56.94
  Bottom 0.203: RYC3.5 69.62,70.68 80.32,73.3 v85.79,74.59 | v153.7,72.34 v154.16,56.94
C4  (via drill 0.6)
  Top 0.203: v106.8,74.71 108,76.23 109.43,76.65 RYC5.8 110.93,78.05 135.89,78.11 143.39,71.84 147.02,71.65 v152.59,71.09 | v152.84,43.02 150.56,43.02 148.78,43.04 147.5,44.3 JP9.4
  Bottom 0.203: RYC4.5 89.56,70.35 103.97,73.62 v106.8,74.71 | v152.59,71.09 152.82,45.65 v152.84,43.02
C5  (via drill 0.6)
  Top 0.203: v125.98,74.34 128.73,74.72 130.09,76.6 | 130.09,76.6 RYC6.8 | 130.09,76.6 131.16,74.56 v140.25,71.92 | JP9.14 147.62,56.95 v142.1,56.95
  Bottom 0.203: RYC5.5 110.31,70.37 118.62,71.27 122.03,73.27 v125.98,74.34 | v140.25,71.92 142.02,70.54 v142.1,56.95
C6  (via drill 0.6)
  Top 0.203: RYC7.8 26.41,66.29 111.39,66.52 127.96,66.95 130.08,68.95 | 130.08,68.95 RYC6.5 | 130.08,68.95 134.73,69.32 140.56,69.2 v140.87,69.15 | v141.2,48 146.83,48.01 148.25,48.05 150,46.76 JP9.5
  Bottom 0.203: v140.87,69.15 141.02,68.49 v141.2,48
C7  (via drill 0.6)
  Top 0.203: v31.26,54.02 34.52,54.9 36.59,56.58 37.47,56.6 38.02,59.25 40.47,59.29 47.27,62.58 | 47.27,62.58 RYC8.8 | 47.27,62.58 48.49,64.31 69.06,64.88 90.87,65.61 110.86,65.92 136.57,66.49 v136.93,67.27 | v137.14,60.76 146.76,60.81 148.41,60.76 150.02,59.49 JP9.15
  Bottom 0.203: RYC7.5 27.7,53.65 30.58,53.61 v31.26,54.02 | v136.93,67.27 v137.14,60.76
C8  (via drill 0.6)
  Top 0.203: v51.96,54.02 56.02,55.06 56.95,56.23 58.13,56.3 58.69,57.19 59.13,58.91 61.66,59.57 RYC9.8 68.9,64.1 90.51,64.83 111.23,65.4 138.6,65.81 v138.65,66.49 | JP9.6 147.55,46.8 v138.91,46.9
  Bottom 0.203: RYC8.5 48.24,53.61 51.35,53.56 v51.96,54.02 | v138.65,66.49 v138.91,46.9 138.95,46.87 138.68,38.5 148.38,36.11 148.27,26.99 139.78,22.05 132.27,20.52 129.88,16.14 87.03,10.88 FET104.2 82.87,9.92 R125.2
C9  (via drill 0.6)
  Top 0.203: v72.93,54.01 76.87,55.35 77.33,56.3 78.78,56.35 79.91,59.12 82.25,59.09 88.78,62.4 | 88.78,62.4 RYC10.8 | 88.78,62.4 90.42,64.22 111.29,64.85 v143.33,65.25 | JP9.16 147.34,59.54 v143.4,59.56
  Bottom 0.203: RYC9.5 69.24,53.49 72,53.49 v72.93,54.01 | v143.33,65.25 v143.4,59.56
C10  (via drill 0.6)
  Top 0.203: v93.74,54.5 97.15,55.09 98.13,56.1 99.79,56.24 100.83,59.18 103.63,59.29 109.52,62.48 | 109.52,62.48 RYC11.8 | 109.52,62.48 111.03,64.22 v139.76,64.37 | v139.97,50.77 146.77,50.61 148.48,50.51 150.09,49.21 JP9.7
  Bottom 0.203: RYC10.5 90.18,53.16 93.09,53.27 v93.74,54.5 | v139.76,64.37 v139.97,50.77
C11  (via drill 0.6)
  Top 0.203: v114.83,54.36 118.4,55.53 119.16,56.43 120.55,56.54 121.26,59.15 123.73,59.23 130.3,62.72 | 130.3,62.72 RYC12.8 | 130.3,62.72 144.76,63.02 146.76,63.35 148.64,63.33 150.02,61.95 JP9.17
  Bottom 0.203: RYC11.5 110.96,53.24 114.39,53.24 v114.83,54.36
C12  (via drill 0.6)
  Top 0.203: RYC13.8 27.72,52.06 113.69,52.15 126.98,53.03 130.4,55.14 | 130.4,55.14 RYC12.5 | 130.4,55.14 v143.3,55.49 | JP9.8 147.41,49.3 v143.35,49.3
  Bottom 0.203: v143.3,55.49 v143.35,49.3
C13  (via drill 0.6)
  Top 0.203: v31.47,38.8 35.9,39.96 37.52,41.68 37.96,43.62 42.19,43.9 47.49,47.12 | 47.49,47.12 RYC14.8 | 47.49,47.12 49.1,48.86 69.2,49.7 91.49,50.59 112,50.79 127.4,51.7 132.69,51.93 v133.08,52.48 | v132.88,61.64 134.47,62.08 147.44,61.98 JP9.18
  Bottom 0.203: RYC13.5 28.89,37.82 30.82,37.92 v31.47,38.8 | v133.08,52.48 v132.88,61.64
C14  (via drill 0.6)
  Top 0.203: v52.31,38.49 56.43,40.07 57.22,40.94 58.55,41.14 59.61,44 62.34,44.02 68.38,47.21 | 68.38,47.21 RYC15.8 | 68.38,47.21 69.25,49.06 91.49,49.95 111.84,50.2 134.91,51.29 v136.2,50.94 | v136.25,53.81 145.76,53.42 146.9,53.02 148.73,53.17 150.02,51.83 JP9.9
  Bottom 0.203: RYC14.5 49.04,37.92 51.61,37.95 v52.31,38.49 | v136.2,50.94 v136.25,53.81
C15  (via drill 0.6)
  Top 0.203: v72.85,38.36 77.29,39.45 78.54,41.19 79.28,41.19 80.15,43.91 82.82,43.97 89.28,47.35 | 89.28,47.35 RYC16.8 | 89.28,47.35 91.14,49.4 111.49,49.55 v134.12,50.15 | v134.02,70.5 147.14,70.6 149.52,68.37 149.92,64.56 JP9.19
  Bottom 0.203: RYC15.5 69.61,37.89 71.71,37.97 v72.85,38.36 | v134.12,50.15 v134.02,70.5
C16  (via drill 0.6)
  Top 0.203: v93.57,38.27 98.21,40.56 100.31,42.06 100.74,43.97 103.93,44.02 109.98,47.32 | 109.98,47.32 RYC17.8 | 109.98,47.32 111.4,48.91 v137.35,49.23 | v137.34,52.53 145.71,52.57 147.54,51.68 JP9.10
  Bottom 0.203: RYC16.5 90.48,38.11 v93.57,38.27 | v137.35,49.23 v137.34,52.53
C17  (via drill 0.6)
  Top 0.203: v114.83,38.63 119.7,40.86 121.17,42.12 121.75,43.78 124.77,43.75 130.87,47.29 | 130.87,47.29 RYC18.8 | 130.87,47.29 v135.22,47.62 | v135.38,67.88 137.21,68.42 140.82,67.97 147.51,67.22 147.6,64.85 JP9.20
  Bottom 0.203: RYC17.5 111.1,37.95 114.5,37.97 v114.83,38.63 | v135.22,47.62 v135.38,67.88
C18  (via drill 0.6)
  Top 0.203: RYC18.5 143.45,39.98 145.53,38.02 152.6,38.08 v154.14,40.52 | v154.08,54.43 JP9.11
  Bottom 0.203: v154.14,40.52 v154.08,54.43
CELL8-PFET-DRAIN  (via drill 0.6)
  Top 0.203: v131.5,14.55 JP1.1
  Bottom 0.203: FET104.3 88.51,9.04 131.53,14.44 v131.5,14.55
EXTERNAL_7-35V
  Bottom 0.203: JP1.3 136.53,19.45 141,14.11 142.62,14.19 JP8.2 | JP8.3 145.28,15.42 JP8.2 | JP2.1 141.87,4.64 JP8.2
FET1-DRAIN
  Bottom 0.203: JP13.2 98.97,25.96 FET101.3
FET2-DRAIN
  Bottom 0.203: JP14.2 110.2,26.12 FET2.3
GND  (via drill 0.6)
  Top 0.203: U$1.18 53.2,23 v53.62,22.45 | U$1.31 v46.68,22.69 | U$1.47 v45.91,15.13 | U$1.12 54.48,20.15 v53.72,19.34 | U$1.63 53.2,13.52 v53.14,14.25 | v51.3,14.44 51.69,14.02 U$1.60
  Top 0.406: QFLY1.2 12.79,73.78 RFLY1.2
  Bottom 0.203: v53.62,22.45 53.19,22.52 | v46.68,22.69 46.67,22.64 | v45.91,15.13 45.77,15.13 | v53.72,19.34 54.05,19.63 | v53.14,14.25 v53.15,14.25 | v51.3,14.44 C117.2
  other vias: 34.46,61.76 55.67,61.76 65.61,59.21 75.86,61.49 85.68,58.41 97.13,61.24 106.06,58.31 117.66,61.39 127.39,58.19 128.04,42.95 118.81,46.64 107.39,43.53 97.69,46.64 86.95,43.84 76.95,46.37 66.4,43.9 56.39,45.93 45.49,42.98 35.55,46.15 23.55,44.49 14.59,46.74 23.43,59.79 13.76,61.88 43.82,59.05 13.14,75.92 22.31,73.52 33.03,75.89 41.68,74.35 53.62,75.61 65.01,71.91 74.77,75.82 85.08,72.25 96.07,75.82 105.86,71.75 116.33,75.75 126.92,72.03 133.03,67.83 93.18,35.18 64.14,16.04 55.64,10.57 30.22,7.74 82.43,4.48 67.27,11.18 63.67,7.46 65.15,7.42
  pour Top (rank 3): -1.89,-0.72 162.32,-0.84 162.4,83.35 -1.75,82.24
  pour Bottom (rank 3): -1.77,82.84 160.2,82.72 160.57,0.07 -3.47,-0.16 -1.75,82.49
LED-EXT-GRN-CATHODE1
  Top 0.203: LED1.C 66.01,20.02 R1.1
LED-EXT-GRN-CATHODE2
  Top 0.203: LED2.C 70.06,16.4 R3.1
LED-EXT-RED-CATHODE1
  Top 0.203: LED4.C 66.04,17.83 R2.1
N$2
  Top 0.203: RM1.2 18.07,76.83 RYC1.10
N$3
  Top 0.203: RP2.1 38.9,69 RYC2.3
N$4
  Top 0.203: RM4.2 80.61,76.62 RYC4.10
N$5
  Top 0.203: RM3.2 59.93,76.83 RYC3.10
N$6
  Top 0.203: RM2.2 39.1,76.76 RYC2.10
N$7
  Top 0.203: RM5.2 101.35,76.78 RYC5.10
N$8
  Top 0.203: RM6.2 122.08,76.55 RYC6.10
N$9
  Top 0.203: JP1.2 130.31,17.04 128.41,11.96 127.74,2.81 U$3.1
N$12
  Top 0.203: RP10.1 80.66,54.7 RYC10.3
N$13
  Top 0.203: RY20.4 135.1,26.46 143.12,26.59 143.23,29.35 JP15.1
N$14
  Top 0.203: RP11.1 101.7,54.83 RYC11.3
N$16
  Top 0.203: RP12.1 122.4,54.91 RYC12.3
N$17
  Top 0.203: RP7.2 18.56,54.83 RYC7.3
N$18
  Top 0.203: RP8.1 39.26,54.96 RYC8.3
N$19
  Top 0.203: RP9.1 60.56,54.79 RYC9.3
N$20  (via drill 0.6)
  Top 0.203: U$1.2 56.44,15.15 v57.38,15.44 | v76.79,20.68 79.36,20.79 R9.2 83.4,20.75 JP3.3
  Bottom 0.203: v57.38,15.44 60.6,16.24 72.38,20.27 75.16,20.38 v76.79,20.68
N$21
  Top 0.203: RY20.9 133.34,28.73 138.3,28.66 140.7,29.25 JP15.2
N$22
  Top 0.203: RY20.10 129.13,32.62 132.69,32.62 134.3,29.61 137.26,29.61 140.78,31.97 JP15.4
N$23
  Top 0.203: RY20.3 134.84,27.58 141.18,27.39 141.91,28.14 141.97,30.11 143.29,31.78 JP15.3
N$25
  Top 0.203: RY20.8 138.45,34.11 140.68,34.42 JP15.6
N$26
  Top 0.203: RY20.5 137.76,25.53 143.58,25.66 145.37,27.8 145.33,33.18 143.16,34.41 JP15.5
N$29
  Top 0.203: RP3.1 59.71,69.08 RYC3.3
N$31
  Top 0.203: RP1.2 18.04,68.97 RYC1.3
N$34
  Top 0.203: RYC7.10 16.13,62.6 RM7.2
N$35
  Top 0.203: RYC10.10 78.56,62.43 RM10.2
N$36
  Top 0.203: RYC9.10 57.83,62.43 RM9.2
N$37
  Top 0.203: RYC8.10 36.88,62.56 RM8.2
N$38
  Top 0.203: RYC11.10 99.18,62.5 RM11.2
N$39
  Top 0.203: RYC12.10 120.06,62.69 RM12.2
N$43
  Top 0.203: RP16.1 81.26,39.65 RYC16.3
N$44
  Top 0.203: RP17.1 102.13,39.65 RYC17.3
N$45
  Top 0.203: RP18.1 123.04,39.69 RYC18.3
N$46
  Top 0.203: RP13.2 18.82,39.26 RYC13.3
N$47
  Top 0.203: RP14.1 39.56,39.65 RYC14.3
N$48
  Top 0.203: RP15.1 60.56,39.65 RYC15.3
N$49
  Top 0.203: RP4.1 80.67,69.08 RYC4.3
N$50
  Top 0.203: RP5.1 101.32,69 RYC5.3
N$51
  Top 0.203: RP6.1 122.31,68.84 RYC6.3
N$58
  Top 0.203: RYC13.10 16.29,47.3 RM13.2
N$59
  Top 0.203: RYC16.10 79.18,47.26 RM16.2
N$60
  Top 0.203: RYC15.10 58.16,47.13 RM15.2
N$61
  Top 0.203: RYC14.10 37.34,47.1 RM14.2
N$62
  Top 0.203: RYC17.10 99.83,47.33 RM17.2
N$63
  Top 0.203: RYC18.10 120.55,47.33 RM18.2
NRST  (via drill 0.6)
  Top 0.203: U$1.7 56.31,17.65 57.89,17.64 58.43,15.41 v58.48,14.16 | R8.1 57.53,9.87 v57.51,8.75 | RESET.1 v57.51,8.75 | v57.51,8.75 57.56,8.7 RESET.2
  Bottom 0.203: v57.51,8.75 v58.48,14.16
PA0-KY040-A  (via drill 0.6)
  Top 0.203: U$1.14 56.45,21.15 58.77,21.9 59.58,22.4 v61.74,22.4 | R6.1 72.57,22.12 v71.42,22.15
  Bottom 0.203: v61.74,22.4 v71.42,22.15 72.57,21.99 76.16,22.09 77.09,22.4 81.38,16.82 JP3.5
PA2-QFLY12  (via drill 0.6)
  Top 0.203: RFLY12.1 117,57.82 QFLY12.1 v117.35,56.6 | v58.52,24.27 56.46,22.15 55.68,22.16 U$1.16
  Bottom 0.203: v117.35,56.6 117.13,34.6 60.58,26.47 v58.52,24.27
PA3-QFLY6  (via drill 0.6)
  Top 0.203: RFLY6.1 117.06,71.72 QFLY6.1 v115.63,69.34 | v56.03,26.81 53.72,25 53.69,24.6 U$1.17
  Bottom 0.203: v115.63,69.34 116.28,35.82 v56.03,26.81
PA4-QFLY17  (via drill 0.6)
  Top 0.203: RFLY17.1 96.48,42.85 QFLY17.1 v97.11,41.64 | v55.08,27.8 52.23,24.9 52.23,24.07 U$1.20
  Bottom 0.203: v97.11,41.64 97.09,33.73 v55.08,27.8
PA5-QFLY11  (via drill 0.6)
  Top 0.203: RFLY11.1 96.84,57.5 QFLY11.1 v96.77,56.33 | v54.18,28.67 51.71,24.86 U$1.21
  Bottom 0.203: v96.77,56.33 95.51,52.26 95.64,34.63 v54.18,28.67
PA6-QFLY5  (via drill 0.6)
  Top 0.203: RFLY5.1 96.14,71.61 QFLY5.1 v96.12,70.37 | v53.1,29.41 51.2,24.84 51.21,24.13 U$1.22
  Bottom 0.203: v96.12,70.37 94.84,52.58 94.6,36.71 v53.1,29.41
PA7-QFLY16  (via drill 0.6)
  Top 0.203: RFLY16.1 75.57,42.44 QFLY16.1 v76.92,40.75 | v52.02,30.36 50.69,24.82 50.71,24.14 U$1.23
  Bottom 0.203: v76.92,40.75 76.03,34.52 v52.02,30.36
PA8-QFLY1  (via drill 0.6)
  Top 0.203: v35.36,26.91 39.41,20.21 43.21,18.14 43.54,18.13 U$1.41
  Top 0.406: QFLY1.1 14.72,71.95 RFLY1.1 v14.72,70.94
  Bottom 0.203: 10.74,69.89 11.22,36.09 10.45,31.63 v35.36,26.91
  Bottom 0.406: 10.74,69.89 v14.72,70.94
PA9-USART1-TX
  Top 0.203: U$1.42 43.46,17.66 33.12,16.3 JP5.5 | JP5.5 | JP5.5 27.33,13.88 14.52,21.85 14.22,24.65 USB-SERIAL.14
PA10-USART1-RX  (via drill 0.6)
  Top 0.203: U$1.43 43.49,17.16 34.32,15.79 v33.97,15.35 | USB-SERIAL.10 26.94,17.67 29.47,16.08 JP5.4
  Bottom 0.203: JP5.4 v33.97,15.35
PA13-SWDIO
  Top 0.203: U$1.46 43.27,15.69 41.94,15.33 39.75,14.88 JP6.3
PA14-SWCLK
  Top 0.203: U$1.49 46.17,11.83 45.92,10.97 42.29,10.99 JP6.2
PB0-QFLY15  (via drill 0.6)
  Top 0.203: RFLY15.1 55.02,42.41 QFLY15.1 v55.61,41.29 | v48.18,32.05 49.2,24.84 49.21,24.14 U$1.26
  Bottom 0.203: v55.61,41.29 55.58,36.74 48.83,33.35 v48.18,32.05
PB1-QFLY9  (via drill 0.6)
  Top 0.203: RFLY9.1 54.72,57.52 QFLY9.1 v54.53,55.85 | v47.42,30.41 48.7,24.83 U$1.27
  Bottom 0.203: v54.53,55.85 54.68,36.82 47.78,33.72 47.05,32.11 v47.42,30.41
PB2-QFLY3  (via drill 0.6)
  Top 0.203: RFLY3.1 54.35,71.93 QFLY3.1 v52.4,69.51 | v45.73,31.83 48.19,24.85 48.2,24.14 U$1.28
  Bottom 0.203: v45.73,31.83 47.28,34.68 53.51,36.89 v52.4,69.51
PB3-RY19-FET-GATE  (via drill 0.6)
  Top 0.203: R12.2 121.42,26.33 QFLY19.1 121.49,26.35 110.65,1.48 76.19,1.43 74.95,1.58 v71.2,3.13 | U$1.55 49.2,11.99 v48.18,10.98
  Bottom 0.203: v48.18,10.98 50.9,9.21 52.18,8.71 53.24,7.93 57.32,2.81 v71.2,3.13
PB5-FET2-GATE  (via drill 0.6)
  Top 0.203: U$1.57 50.18,11.92 v49.77,10.99 | v72.54,4.75 v76.56,3.66 | v98.94,8.66 v98.55,16.26
  Bottom 0.203: v49.77,10.99 51.14,9.79 52.24,9.23 53.62,8.35 55.96,5.75 58.83,4.5 71.01,4.36 v72.54,4.75 | v76.56,3.66 88.04,1.36 93.13,1.44 v98.94,8.66 | v98.55,16.26 103.79,23.34 103.84,24.73 R10.1 105.82,24.98 FET2.1
PB6-I2C1-SCL
  Top 0.203: R14.2 40.25,5.61 43.54,6.95 JP11.4 43.58,6.89 44.43,8.57 50.72,10.21 U$1.58
PB7-I2C2-SDA
  Top 0.203: R11.2 45.67,4.66 46.19,6.84 JP11.3 46.14,6.83 46.91,8.57 51.19,9.88 51.2,11.98 U$1.59
PB8-FET1-GATE  (via drill 0.6)
  Top 0.203: U$1.61 52.2,11.87 52.21,10.66 v52.66,10.17 | v74.16,12.46 v77.5,12.79
  Bottom 0.203: v52.66,10.17 54.5,8.89 56.3,7.03 59.39,5.6 70.81,5.33 72.05,7.85 v74.16,12.46 | v77.5,12.79 86.33,14 87.85,23.66 91.46,24.72 R103.1 93.85,24.96 FET101.1
PB9-CELL8-NFET  (via drill 0.6)
  Top 0.203: U$1.62 52.7,12.01 52.87,11.31 v54.07,10.83 | v69.96,6.49 72.63,6.38 v75.84,5.9
  Bottom 0.203: v54.07,10.83 56.58,7.7 59.52,6.46 v69.96,6.49 | 76.78,5.87 76.76,5.87 v75.84,5.9 | 76.78,5.87 R5.2 | 76.78,5.87 76.78,5.85 FET1.1
PB10-QFLY14  (via drill 0.6)
  Top 0.203: QFLY14.1 34.36,42.52 RFLY14.1 v35.42,41.04 | v43.8,30.51 46.76,27.44 47.69,24.86 47.69,24.13 U$1.29
  Bottom 0.203: v43.8,30.51 41.58,32.92 35.53,34.93 v35.42,41.04
PC0-IN10  (via drill 0.6)
  Top 0.203: v17.82,71.91 RP1.1 | 122.19,70.77 RP6.2 v122.26,71.77 | RP7.1 18.5,56.68 v18.56,58.1 | v18.74,42.42 RP13.1 | v39.31,42.73 RP14.2 | RP8.2 39.12,56.63 v39.12,57.8 | v38.92,71.9 RP2.2 | v59.72,72.05 RP3.2 | RP9.2 60.23,56.56 v60.17,57.86 | v60.53,42.68 RP15.2 | v80.6,72.18 RP4.2 | RP10.2 80.71,56.63 v80.68,57.92 | v101.31,71.96 RP5.2 | RP11.2 101.73,56.79 v101.67,57.84 | v81.05,42.5 RP16.2 | v101.97,42.59 RP17.2 | RP12.2 122.36,57.99 v122.39,57.9 | v122.76,42.54 RP18.2 | 60.38,35.81 v39.21,35.86 39.2,35.79 v18.47,35.84 18.5,35.86 JP7.1 | 60.38,35.81 v60.41,35.81 | 60.38,35.81 60.38,35.82 66.55,35.89 | 66.55,35.89 v80.98,36.04 81,36.06 v101.9,36.08 101.88,36.06 v122.72,36.08 | U$1.8 56.41,18.14 59.35,18.14 60.17,20.02 63.1,22.08 | 66.55,35.89 63.1,22.08 | RP19.2 63.6,22.05 63.1,22.08
  Bottom 0.203: v17.82,71.91 18.22,66.41 v18.56,58.1 18.5,58.15 v18.74,42.42 18.71,42.38 18.7,36.45 18.5,35.91 v18.47,35.84 | v38.92,71.9 39.18,57.8 v39.12,57.8 v39.31,42.73 39.31,42.78 39.44,36.47 39.23,35.85 v39.21,35.86 | v59.72,72.05 v60.17,57.86 v60.53,42.68 | v80.6,72.18 v80.68,57.92 80.74,57.92 v81.05,42.5 81.21,36.65 81.02,36.07 v80.98,36.04 | v101.31,71.96 v101.67,57.84 101.7,58.21 v101.97,42.59 102.13,36.69 101.93,36.05 v101.9,36.08 | v122.26,71.77 v122.39,57.9 122.43,57.92 v122.76,42.54 122.95,36.69 122.72,36.03 v122.72,36.08 | v60.41,35.81 60.46,35.85 60.64,36.42
  Bottom 0.406: v60.53,42.68 60.51,42.59 60.64,36.42
PC1-LED-RED  (via drill 0.6)
  Top 0.203: U$1.9 56.48,18.65 v58.33,18.99 | v60.4,17.51 62.33,17.8
  Top 0.61: 62.33,17.8 R2.2
  Bottom 0.203: v58.33,18.99 v60.4,17.51
PC2-LED-GRN  (via drill 0.6)
  Top 0.203: U$1.10 56.41,19.15 v58.92,20.26 | R1.2 62.38,19.96 v60.93,18.94
  Bottom 0.203: v58.92,20.26 v60.93,18.94
PC3-QFLY18  (via drill 0.6)
  Top 0.203: RFLY18.1 117.73,42.76 QFLY18.1 v118.84,41.72 | v59.85,21.43 58.43,21.06 56.42,19.65 55.64,19.63 U$1.11
  Bottom 0.203: v118.84,41.72 118.22,33.53 61.27,25.49 v59.85,21.43
PC4-QFLY10  (via drill 0.6)
  Top 0.203: RFLY10.1 QFLY10.1 v75.33,55.97 | v50.79,31.07 50.19,24.85 50.21,24.18 U$1.24
  Bottom 0.203: v75.33,55.97 74.66,35.37 v50.79,31.07
PC5-QFLY4  (via drill 0.6)
  Top 0.203: RFLY4.1 74.68,71.75 QFLY4.1 v73.94,69.6 | v49.79,32.12 49.71,24.84 49.72,24.12 U$1.25
  Bottom 0.203: v73.94,69.6 73.85,36.42 v49.79,32.12
PC6-QFLY8  (via drill 0.6)
  Top 0.203: QFLY8.1 34.03,57.56 RFLY8.1 v33.61,56 | v40.77,31.29 41.23,21.96 43.43,20.15 U$1.37
  Bottom 0.203: v33.61,56 34.57,34.42 v40.77,31.29
PC7-QFLY2  (via drill 0.6)
  Top 0.203: QFLY2.1 33.51,71.79 RFLY2.1 v31.81,69.42 | v39.53,30.29 40.65,21.62 43.37,19.66 44.23,19.64 U$1.38
  Bottom 0.203: v31.81,69.42 32.3,56.08 32.4,34.11 v39.53,30.29
PC8-QFLY13  (via drill 0.6)
  Top 0.203: QFLY13.1 13.86,41.92 RFLY13.1 v14.29,40.67 | v38.19,28.96 40.2,21.22 43.31,19.15 U$1.39
  Bottom 0.203: v14.29,40.67 14.28,36.98 18.2,34.45 v38.19,28.96
PC9-QFLY7  (via drill 0.6)
  Top 0.203: QFLY7.1 13.56,57.87 RFLY7.1 v12.95,56.14 | v36.8,27.86 39.64,20.81 43.3,18.62 43.51,18.64 U$1.40
  Bottom 0.203: v12.95,56.14 13.08,36.67 16.64,33.34 33.63,28.7 v36.8,27.86
QDFLY1
  Top 0.203: ZD1.C 8.85,74.41 | 8.85,74.41 RYC1.- | 8.85,74.41 10.6,74.44 10.61,72.83 QFLY1.3 10.6,72.84 Z1.3
QDFLY2
  Top 0.203: RYC2.- 29.75,74.25 ZD2.C 29.6,72.78 Z2.3 31.57,72.81 QFLY2.3
QDFLY3
  Top 0.203: ZD3.C 50.22,74.56 | 50.22,74.56 RYC3.- | QFLY3.3 52.19,72.95 Z3.3 50.22,74.56
QDFLY4
  Top 0.203: 71.03,74.26 ZD4.C 71,74.24 Z4.3 | 71.03,74.26 RYC4.- | QFLY4.3 72.66,72.78 71.03,74.26
QDFLY5
  Top 0.406: RYC5.- 92.38,74.35 ZD5.C 91.8,72.65 Z5.3 QFLY5.3
QDFLY6
  Top 0.203: 113.53,74.3 ZD6.C 112.73,72.42 Z6.3 | 113.53,74.3 RYC6.- | QFLY6.3 113.53,74.3
QDFLY7
  Top 0.203: RYC7.- 9.88,60.04 ZD7.C 9.73,58.4 Z7.3 11.83,58.64 QFLY7.3
QDFLY8
  Top 0.203: RYC8.- 30.17,60.16 ZD8.C 29.61,58.39 Z8.3 31.98,58.58 QFLY8.3
QDFLY9
  Top 0.203: RYC9.- 51.05,60.26 ZD9.C 50.58,58.48 Z9.3 QFLY9.3
QDFLY10
  Top 0.203: RYC10.- 71.52,60.35 ZD10.C 71.11,58.48 Z10.3 73.59,58.46 QFLY10.3
QDFLY11
  Top 0.203: RYC11.- 92.7,60.11 ZD11.C 92.05,58.32 Z11.3 94.35,58.49 QFLY11.3
QDFLY12
  Top 0.203: RYC12.- 113.07,60.23 ZD12.C 112.82,58.69 Z12.3 115.03,58.84 QFLY12.3
QDFLY13
  Top 0.203: 10.89,44.78 ZD13.C 9.84,43.03 Z13.3 | 10.89,44.78 RYC13.- | QFLY13.3 11.98,43.24 10.89,44.78
QDFLY14
  Top 0.203: RYC14.- 30.2,45.08 ZD14.C 29.99,43.24 Z14.3 31.73,43.44 QFLY14.3
QDFLY15
  Top 0.203: RYC15.- 51.48,44.85 ZD15.C 51,43.28 Z15.3 53.02,43.4 QFLY15.3
QDFLY16
  Top 0.203: RYC16.- 72.24,45.01 ZD16.C 71.54,43.21 Z16.3 73.82,43.37 QFLY16.3
QDFLY17
  Top 0.203: RYC17.- 92.88,45.17 ZD17.C 92.45,43.28 Z17.3 94.48,43.87 QFLY17.3
QDFLY18
  Top 0.203: 114.17,45.15 ZD18.C 113.31,43.44 Z18.3 | 114.17,45.15 RYC18.- | QFLY18.3 115.48,43.69 114.17,45.15
QFLY19-DRAIN
  Top 0.203: RY20.- 117.88,31.15 Z19.3 119.34,27.23 QFLY19.3
USB-SERIAL-5V
  Bottom 0.203: JP5.3 17.1,11.63 16.83,9.37 USB-SERIAL.4 | JP4.4 76.29,15.91 73.91,1.89
  Bottom 0.406: 73.91,1.89 18.96,1.99 16.75,9.37 USB-SERIAL.4
VCAP_1  (via drill 0.6)
  Top 0.203: U$1.30 47.21,24.8 v46.45,25.64
  Bottom 0.203: v46.45,25.64 46.55,25.49 45.65,25.54 C1.1
VCC  (via drill 0.6)
  Top 0.203: U$1.32 45.7,24.1 v45.15,23.89 | U$1.48 44.24,14.3 v44.66,13.64 | U$1.19 52.69,23.17 v52.22,22.4 | U$1.64 54.3,12.68 v54.76,13.19 | v49.44,18.41 49.4,18.45
  Top 0.406: v60.01,12.92 60.06,12.92
  Bottom 0.203: C7.1 44.71,22.9 v45.15,23.89 | C102.1 45.49,13.36 v44.66,13.64 | 52.27,22.57 v52.22,22.4 50.89,22.42 C106.1 | C117.1 54.29,12.92 v54.76,13.19 | BEAD.1 v49.44,18.41
  Bottom 0.406: C124.1 v60.01,12.92
  pour Top (rank 2): 42.65,11.51 57.6,11.48 58.01,11.48 61.53,11.51 61.61,13.04 58.01,14.7 57.6,25.04 42.9,25.67
VDDA  (via drill 0.6)
  Top 0.203: U$1.13 54.91,20.63 v53.82,20.66
  Bottom 0.203: v53.82,20.66 53.51,20.58 52.18,20.64 C105.1 52.28,20.53 BEAD.2

### Text on the board
bNames: 5
tValues: 3.3V | DIGITAL | +5V | 3.2v | ANALOG | 3.2